# EAGLE design BSIextensionBoard (EAGLE 9.0.1)
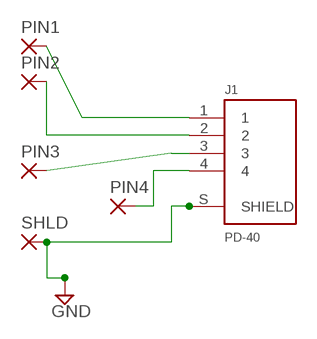
[diagram p0: schematic, sheet 1]

## Parts
J1  PD-40  [CUI_PD-40]
PIN1  3,81/1,4  [3,81/1,4]
PIN2  3,81/1,4  [3,81/1,4]
PIN3  3,81/1,4  [3,81/1,4]
PIN4  3,81/1,4  [3,81/1,4]
SHLD  3,81/1,4  [3,81/1,4]

## Nets
GND: J1.S(SHIELD) SHLD.1(P)
N$1: J1.1 PIN1.1(P)
N$2: J1.2 PIN2.1(P)
N$3: J1.3 PIN3.1(P)
N$5: J1.4 PIN4.1(P)

## Library data of the parts
J1 = PD-40:PD-40: 4 Position , 7.5 A, Right Angle, Through Hole, Power DIN Connector; MF: CUI Inc; PARTREV: B; STANDARD: Manufacturer recommendations
PIN1-PIN4 SHLD = wirepad:3,81/1,4: THROUGH-HOLE PAD

## Board
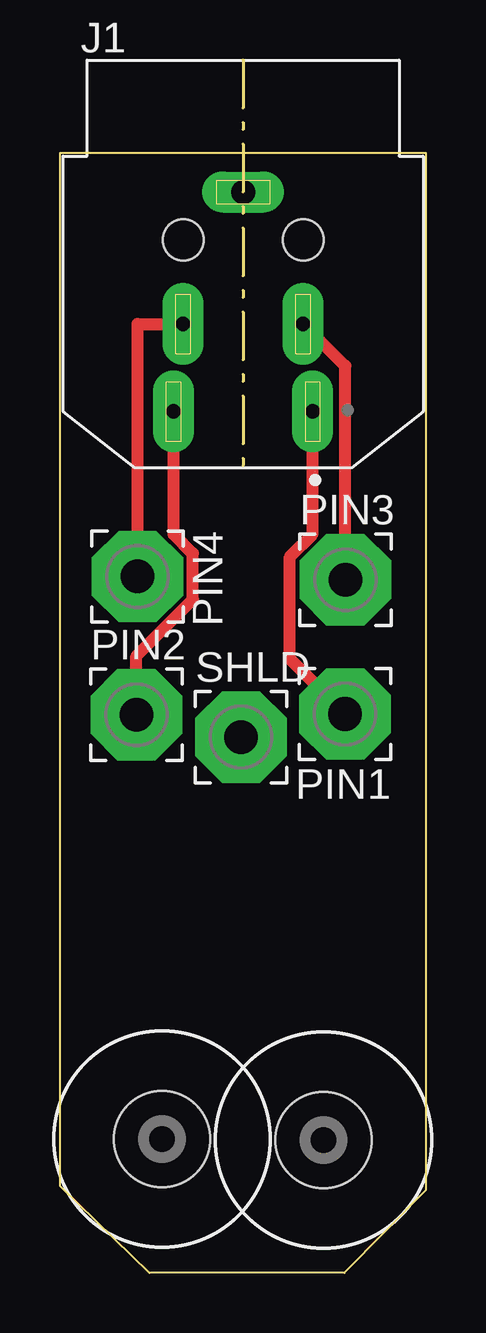
[diagram p1: board, top side]
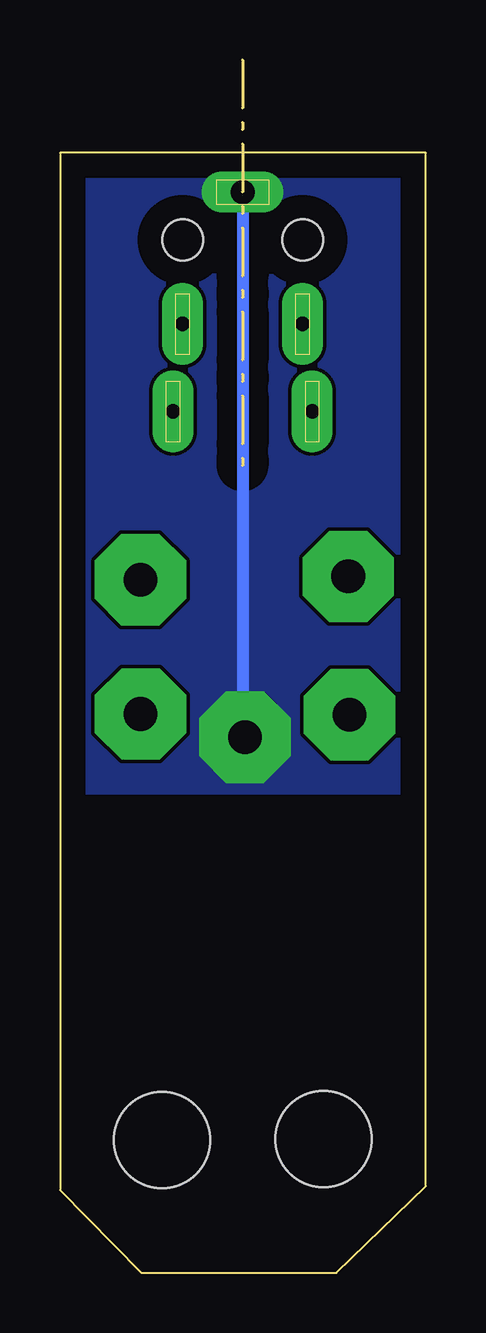
[diagram p2: board, bottom side, seen from below]

Size 15.24 x 46.69 mm. Coordinates in mm from the lower left corner, seen from the top.
Outline: 0,46.69 15.24,46.69 15.24,3.46 11.85,0 3.73,0 0,3.62 0,46.69
Copper layers (1*16): Top 0.035mm / dielectric 1.5mm / Bottom 0.035mm
Design rules "default": minimum track width 6mil, minimum drill 0.35mm, track to track 6mil, track to pad 6mil, pad to pad 6mil, via to via 6mil, smd to smd 6mil, copper to edge 40mil, drill to drill 6mil, minimum pad ring 10mil, minimum via ring 8mil, stop-mask expansion 4mil, vias tented up to drill 0mil, thermal gap 10mil

### Footprints (pad centres in the part's own frame; a part is rotated, then mirrored left to right if it is on the bottom)
CUI_PD-40 = drill 0.6 pad 1.7 long: 1 2.9,-7.15; 2 -2.9,-7.15; 3 2.5,-3.5; 4 -2.5,-3.5 | drill 1 pad 1.7 long: S 0,2 | hole 1.7: -2.5,0; 2.5,0
3,81/1,4 = drill 1.397 pad 3.81 octagon: 1 0,0
DRIL-4 = hole 4: 0,0

### Placement (x,y rotation side)
J1  7.63,43.06 0 top
PIN1  11.88,23.3 180 top
PIN2  3.18,23.27 0 top
PIN3  11.89,28.9 0 top
PIN4  3.23,29.03 270 top
SHLD  7.54,22.34 0 top
U$1  [DRIL-4]  4.26,5.59 0 top
U$2  [DRIL-4]  10.98,5.54 0 top

### Tracks (layer width: path | path; a pad name or v marks a point on that pad's centre or on a via)
GND
  Bottom 0.508: J1.S 7.63,22.43 SHLD.1
  pour Bottom (no thermals): 0,46.68 0.04,46.64 15.22,46.64 15.22,20.12 15.26,20.08 0.04,20.08 0,20.04
N$1
  Top 0.508: J1.1 10.53,30.81 9.58,29.86 9.58,25.6 PIN1.1
N$2
  Top 0.508: PIN2.1 3.18,25.71 5.54,28.07 5.54,29.99 4.73,30.8 J1.2
N$3
  Top 0.508: PIN3.1 11.89,37.8 J1.3
N$5
  Top 0.508: PIN4.1 3.23,39.56 J1.4